# Altium project Altium101.PrjPcb (part 2 of 2)

## Sheet Wifi.SchDoc
size A3; CompanyName: Ok's Lab; Engineer: Oktay Topcu; SheetNumber: 6; SheetTotal: 7; UniqueID: 20200803; X1: Altium101.PrjPcb; X2: A3; X3: 20200803; X4: r1.0; X6: 6; X7: 7; X8: Wifi.SchDoc
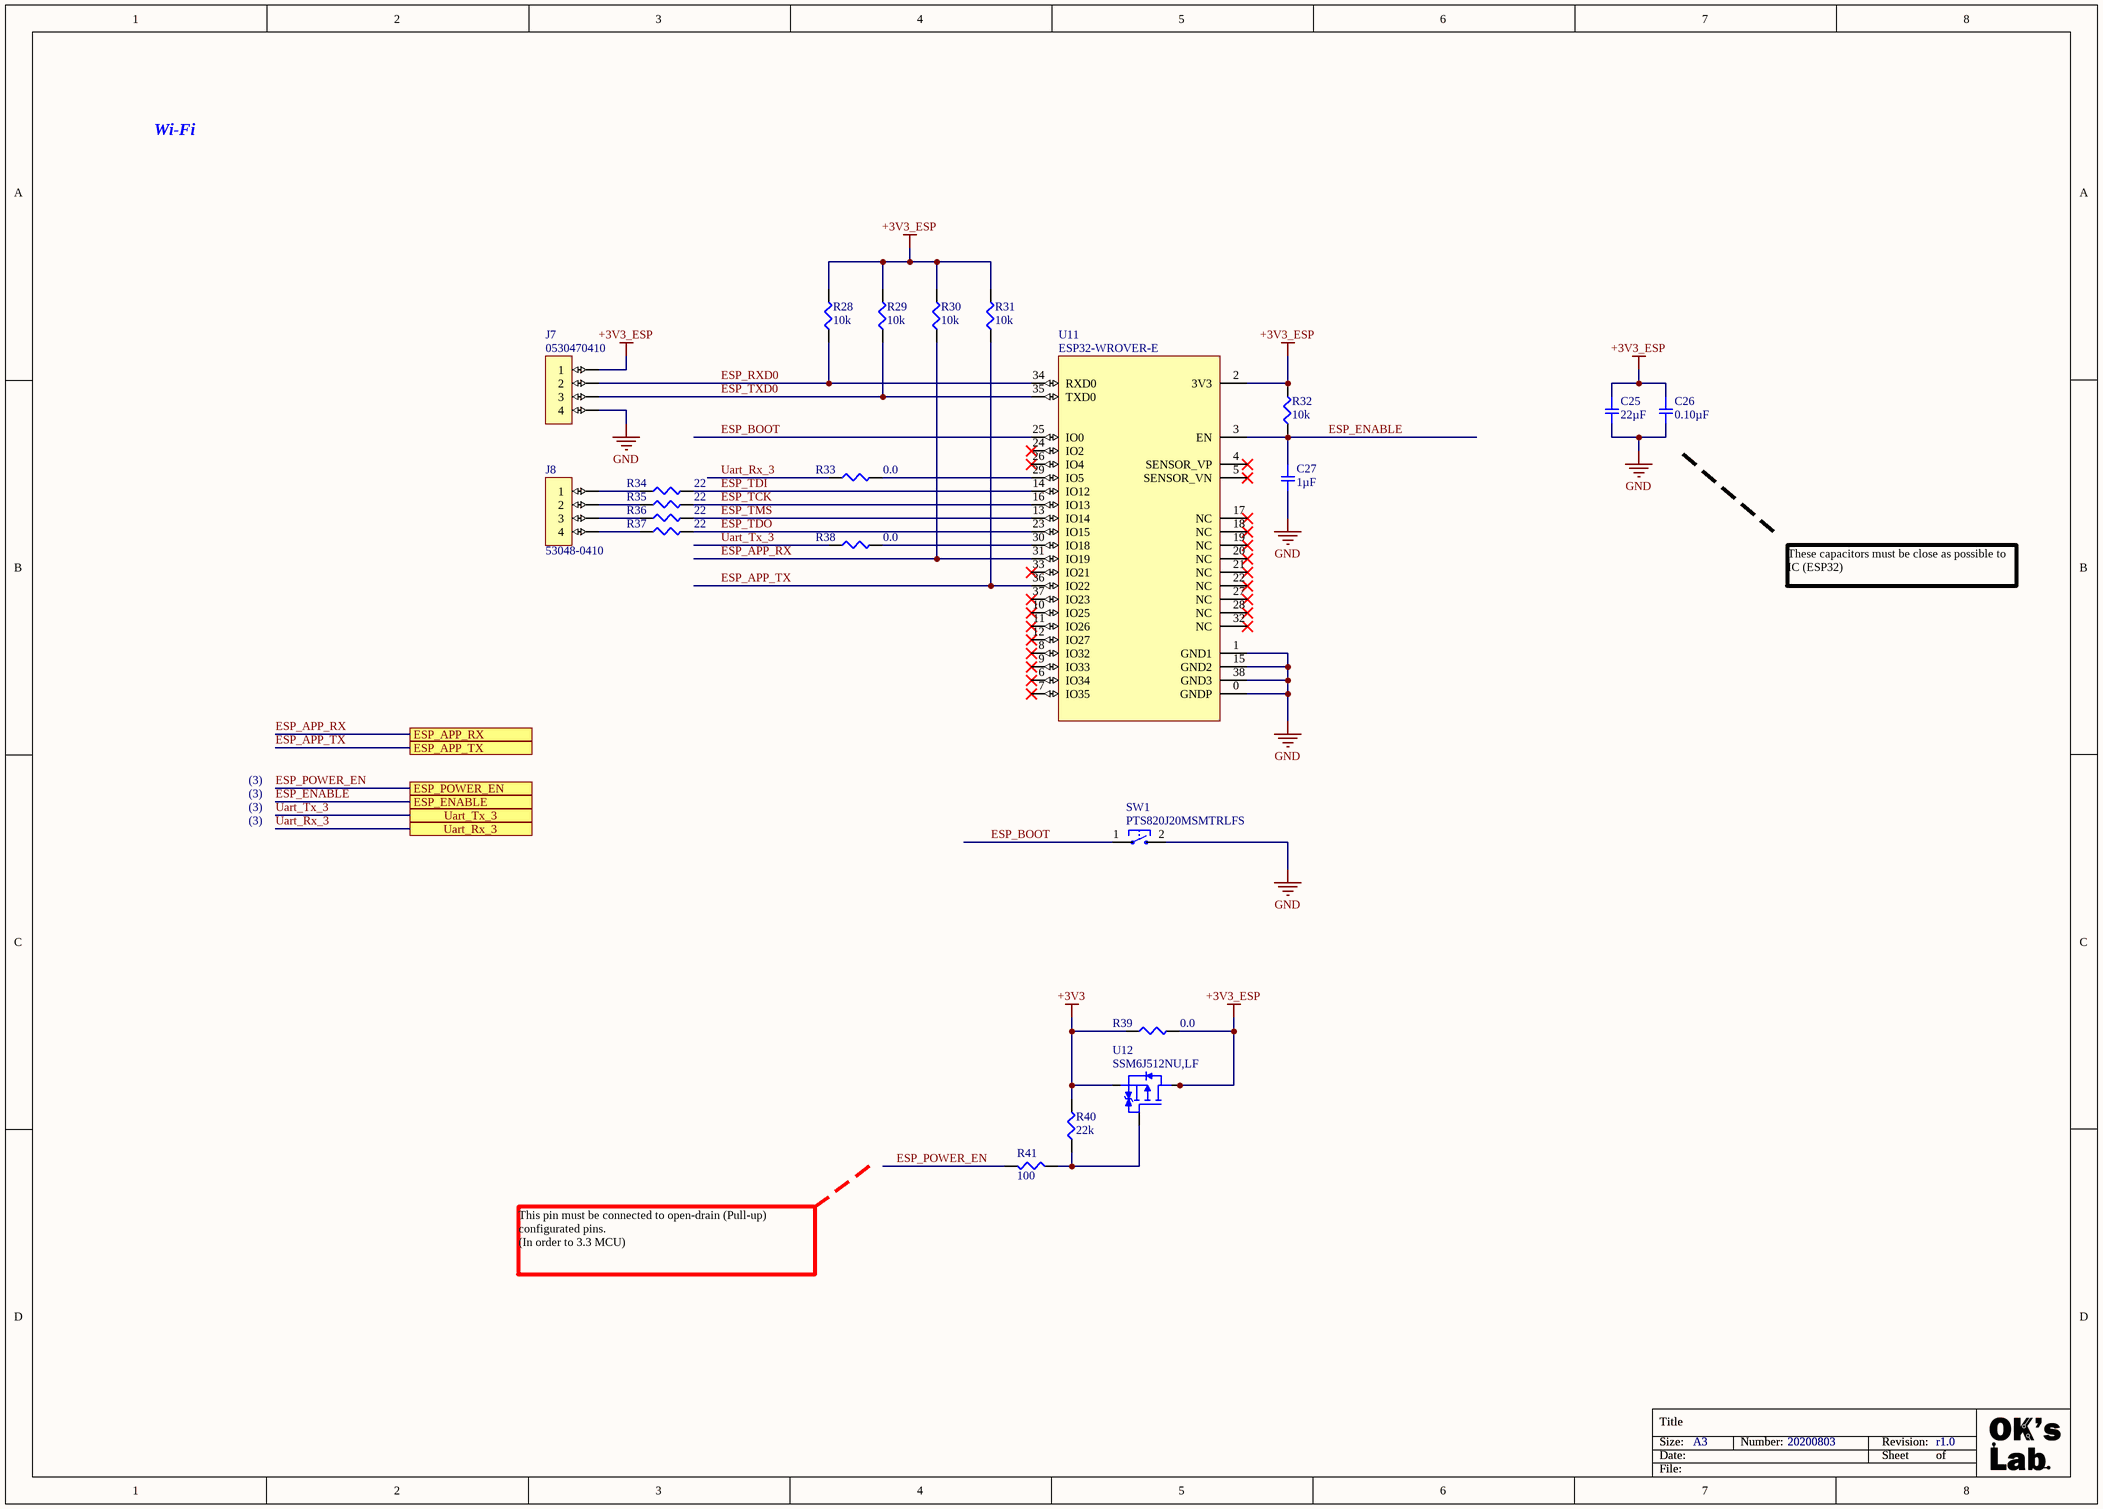
[diagram p5: Wifi.SchDoc]

### Parts
C25  22µF  [SMD-0805C]
C26  0.10µF  [SMD-0603C]
C27  1µF  [SMD-0603C]
J7  0530470410  [CONN_4_POS__053047-0410]
J8  53048-0410  [CONN_4_POS__0530480410]
R28  10k  [SMD-0603-RES]
R29  10k  [SMD-0603-RES]
R30  10k  [SMD-0603-RES]
R31  10k  [SMD-0603-RES]
R32  10k  [SMD-0603-RES]
R33  0.0  [SMD-0603-RES]
R34  22  [SMD-0603-RES]
R35  22  [SMD-0603-RES]
R36  22  [SMD-0603-RES]
R37  22  [SMD-0603-RES]
R38  0.0  [SMD-0603-RES]
R39  0.0  [SMD-0603-RES]
R40  22k  [SMD-0603-RES]
R41  100  [SMD-0603-RES]
SW1  PTS820J20MSMTRLFS  [TACTILE_SWITCH__PTS820J25MSMTRLFS]
U11  ESP32-WROVER-E  [ESP32-WROVER-E]
U12  SSM6J512NU,LF  [U-DFN2020-6]

### Ports
ESP_APP_RX, ESP_APP_TX, ESP_ENABLE, ESP_POWER_EN, Uart_Rx_3, Uart_Tx_3

### Nets
+3V3: R39.1 R40.2 U12.4(S)
+3V3_ESP: C25.1 C26.1 J7.1 R28.2 R29.2 R30.2 R31.2 R32.2 R39.2 U11.2(3V3) U12.1(D) U12.2(D) U12.5(D) U12.6(D)
GND: C25.2 C26.2 C27.2 J7.4 SW1.2 U11.0(GNDP) U11.1(GND1) U11.15(GND2) U11.38(GND3)
ESP_APP_RX: R30.1 U11.31(IO19) ; port ESP_APP_RX
ESP_APP_TX: R31.1 U11.36(IO22) ; port ESP_APP_TX
ESP_BOOT: SW1.1 U11.25(IO0)
ESP_ENABLE: C27.1 R32.1 U11.3(EN) ; port ESP_ENABLE
ESP_POWER_EN: R41.2 ; port ESP_POWER_EN
ESP_RXD0: J7.2 R28.1 U11.34(RXD0)
ESP_TCK: R35.2 U11.16(IO13)
ESP_TDI: R34.2 U11.14(IO12)
ESP_TDO: R37.2 U11.23(IO15)
ESP_TMS: R36.2 U11.13(IO14)
ESP_TXD0: J7.3 R29.1 U11.35(TXD0)
Uart_Rx_3: R33.1 ; port Uart_Rx_3
Uart_Tx_3: R38.1 ; port Uart_Tx_3
NetJ8_1: J8.1 R34.1
NetJ8_2: J8.2 R35.1
NetJ8_3: J8.3 R36.1
NetJ8_4: J8.4 R37.1
NetR33_2: R33.2 U11.29(IO5)
NetR38_2: R38.2 U11.30(IO18)
NetR40_1: R40.1 R41.1 U12.3(G)

Not connected (* = marked no-connect by the designer): U11 4(SENSOR_VP)* 5(SENSOR_VN)* 6(IO34)* 7(IO35)* 8(IO32)* 9(IO33)* 10(IO25)* 11(IO26)* 12(IO27)* 17(NC)* 18(NC)* 19(NC)* 20(NC)* 21(NC)* 22(NC)* 24(IO2)* 26(IO4)* 27(NC)* 28(NC)* 32(NC)* 33(IO21)* 37(IO23)*

### Notes on the sheet
- Wi-Fi
- These capacitors must be close as possible to IC (ESP32)
- (3)
- This pin must be connected to open-drain (Pull-up) configurated pins.
  (In order to 3.3 MCU)
- Title
- Size:
- Date:
- Number:
- Revision:
- Sheet
- of
- File:

### Library data of the parts
C25 = GRM21BC80J226ME51L: CAP CER 22UF 6.3V X6S 0805; Manufacturer: Murata Electronics North America; Factory Stock: 0; Unit Price (USD): 0.24; Minimum Quantity: 1; Tolerance: ±20%; Datasheets: http://www.murata.com/~/media/webrenewal/support/library/catalog/products/capacitor/mlcc/c02e.pdf; Image: //media.digikey.com/Renders/Murata%20Renders/0805%20(2012%20Metric)%20.85mm.jpg; Digi-Key Part Number: 490-9955-1-ND; Part Number: GRM21BC80J226ME51L; Quantity Available: 773; @ qty: 0; Packaging: Cut Tape (CT); Series: GRM; Part Status: Active; Value: 22µF; Voltage: 6.3V; Temperature Coefficient: X6S; Operating Temperature: -55°C ~ 105°C; Features: Derating Recommended; Ratings: -; Applications: General Purpose; Mounting Type: Surface Mount, MLCC; Package / Case: 0805 (2012 Metric); Size / Dimension: 0.079" L x 0.049" W (2.00mm x 1.25mm); Height - Seated (Max): -; Thickness (Max): 0.055" (1.40mm); Lead Spacing: -; Lead Style: -
C26 = GCJ188R71H104KA12D: CAP CER 0.1UF 50V X7R 0603; Manufacturer: Murata Electronics North America; Factory Stock: 0; Unit Price (USD): 0.12; Minimum Quantity: 1; Tolerance: ±10%; Datasheets: http://www.murata.com/~/media/webrenewal/support/library/catalog/products/capacitor/mlcc/c03e.ashx; Image: //media.digikey.com/Renders/Murata%20Renders/0603%28LQG18%29.jpg; Digi-Key Part Number: 490-5798-1-ND; Part Number: GCJ188R71H104KA12D; Quantity Available: 163695; @ qty: 0; Packaging: Cut Tape (CT); Series: GCJ; Part Status: Active; Value: 0.10µF; Voltage: 50V; Temperature Coefficient: X7R; Operating Temperature: -55°C ~ 125°C; Features: Soft Termination; Ratings: AEC-Q200; Applications: Automotive, Boardflex Sensitive; Mounting Type: Surface Mount, MLCC; Package / Case: 0603 (1608 Metric); Size / Dimension: 0.063" L x 0.031" W (1.60mm x 0.80mm); Height - Seated (Max): -; Thickness (Max): 0.035" (0.90mm); Lead Spacing: -; Lead Style: -
C27 = GCM188R71C105KA64D: CAP CER 1UF 16V X7R 0603; Manufacturer: Murata Electronics North America; Factory Stock: 0; Unit Price (USD): 0.24; Minimum Quantity: 1; Tolerance: ±10%; Datasheets: http://www.murata.com/~/media/webrenewal/support/library/catalog/products/capacitor/mlcc/c03e.ashx; Image: //media.digikey.com/Renders/Murata%20Renders/0603%28GCM188%29.jpg; Digi-Key Part Number: 490-5241-1-ND; Part Number: GCM188R71C105KA64D; Quantity Available: 9243; @ qty: 0; Packaging: Cut Tape (CT); Series: GCM; Part Status: Active; Value: 1µF; Voltage: 16V; Temperature Coefficient: X7R; Operating Temperature: -55°C ~ 125°C; Features: -; Ratings: AEC-Q200; Applications: Automotive; Mounting Type: Surface Mount, MLCC; Package / Case: 0603 (1608 Metric); Size / Dimension: 0.063" L x 0.031" W (1.60mm x 0.80mm); Height - Seated (Max): -; Thickness (Max): 0.035" (0.90mm); Lead Spacing: -; Lead Style: -
J7 = CONN_4_POS__53047-0410: 1.25mm (.049") Pitch PicoBlade Wire-to-Board Header, Vertical, with Friction Lock, 4 Circuits; Manufacturer: Molex; Number of Contacts: 4; Contact Resistance: 20mR; Max Voltage Rating (AC): 125V; Connector Type: Blade Pin; Pitch: 0.049inch; Supplier 1: Avnet; Manufacturer Part Number: 0530470410; Stock 1: 65946; Pricing 1: 1=0.1162, 10=0.1145, 30=0.1129, 50=0.1112, 100=0.1088, 250=0.1063, 500=0.1038 (USD); Mount: Through Hole; Contact Plating: Tin; Contact Material: Bronze; Color: Natural; Housing Color: White; Housing Material: Nylon; Min Operating Temperature: -40°C; Max Operating Temperature: 85°C; Termination: Solder; Number of Rows: 1; Packaging: Tray; Number of Positions: 4; Orientation: Straight; Series: PicoBlade™ 53047; Contact Type: Blade Pin; Length: 6.75mm; Depth: 3.2mm; Contact Mating Length: 0.089inch; RoHS Compliant: Yes; ComponentLink1URL: http://components.arrow.com/part/dataview/2938462S4237926N3303?src-supplier=Arrow+Electronics; ComponentLink1Description: http://components.arrow.com/part/dataview/2938462S4237926N3303?src-supplier=Arrow+Electronics; Supplier Part Number 1: 0530470410
J8 = CONN_4_POS__0530480410: CONN HEADER R/A 4POS 1.25MM; Manufacturer: Molex; Contact Resistance: 20mR; Current Rating: 1A; Voltage Rating: 125V; Number of Positions: 4; Insulation Resistance: 100MR; Gender: Male; Connector Type: Blade Pin; Glow Wire Compliant: Non-compliant; Supplier 1: Avnet; Manufacturer Part Number: 53048-0410; Stock 1: 44; Pricing 1: 1=0.1232 (USD); Mount: Through Hole; Case/Package: 0410; Contact Material: Bronze,Tin; Contact Plating: Tin; Color: Natural; Housing Color: Natural; Housing Material: Nylon; Min Operating Temperature: -40°C; Max Operating Temperature: 85°C; Package Quantity: 5000; Number of Rows: 1; Packaging: Tray; Contact Gender: Male; Termination: Solder; Number of Contacts: 4; Orientation: Right Angle; Number of Circuits: 4; Voltage Rating (DC): 125V; Series: PicoBlade; Contact Type: Blade Pin; Pitch: 1.25mm; Depth: 5.5mm; Radiation Hardening: No; REACH SVHC: Unknown; Lead Free: Lead Free; Flammability Rating: UL94 V-0; RoHS Compliant: Yes; ComponentLink1URL: https://www.distrelec.biz/Web/Downloads/60/_e/gg116847-116860_e.pdf?mime=application%2Fpdf&src-supplier=Distrelec; ComponentLink1Description: https://www.distrelec.biz/Web/Downloads/60/_e/gg116847-116860_e.pdf?mime=application%2Fpdf&src-supplier=Distrelec; ComponentLink2URL: http://uk.rs-online.com/webdocs/1362/0900766b81362ba7.pdf?src-supplier=RSComponents; ComponentLink2Description: http://uk.rs-online.com/webdocs/1362/0900766b81362ba7.pdf?src-supplier=RSComponents; ComponentLink3URL: http://www.molex.com/webdocs/datasheets/pdf/en-us/0530480410_PCB_HEADERS.pdf?src-supplier=Avnet; ComponentLink3Description: http://www.molex.com/webdocs/datasheets/pdf/en-us/0530480410_PCB_HEADERS.pdf?src-supplier=Avnet; ComponentLink4URL: http://www.mouser.com/ds/2/276/0530480410_PCB_HEADERS-170930.pdf?src-supplier=Mouser; ComponentLink4Description: http://www.mouser.com/ds/2/276/0530480410_PCB_HEADERS-170930.pdf?src-supplier=Mouser; Supplier Part Number 1: 53048-0410
R28-R32 = ERJ-3EKF1002V: RES SMD 10K OHM 1% 1/10W 0603; Manufacturer: Panasonic Electronic Components; Factory Stock: 0; Unit Price (USD): 0.00379; @ qty: 1500; Minimum Quantity: 1; Power (Watts): 0.1W, 1/10W; Temperature Coefficient: ±100ppm/°C; Part Number: ERJ-3EKF1002V; Datasheets: http://industrial.panasonic.com/www-cgi/jvcr13pz.cgi?E+PZ+3+AOA0002+ERJ3EKF1002V+7+WW; Image: //media.digikey.com/Photos/Panasonic%20Photos/MFG_ERJ-P6W%20Series.jpg; Digi-Key Part Number: P10.0KHCT-ND; Quantity Available: 6703141; Packaging: Cut Tape (CT); Series: ERJ; Part Status: Active; Value: 10k; Tolerance: ±1%; Composition: Thick Film; Features: Automotive AEC-Q200; Operating Temperature: -55°C ~ 155°C; Package / Case: 0603 (1608 Metric); Supplier Device Package: 0603; Size / Dimension: 0.063" L x 0.031" W (1.60mm x 0.80mm); Height - Seated (Max): 0.022" (0.55mm); Number of Terminations: 2; Failure Rate: -
R33 R38 R39 = ERJ-3GEY0R00V: RES SMD 0.0OHM JUMPER 1/10W 0603; Manufacturer: Panasonic Electronic Components; Factory Stock: 0; Unit Price (USD): 0.00352; @ qty: 1500; Minimum Quantity: 1; Power (Watts): 0.1W, 1/10W; Part Number: ERJ-3GEY0R00V; Datasheets: http://industrial.panasonic.com/www-cgi/jvcr13pz.cgi?E+PZ+3+AOA0001+ERJ3GEY0R00V+7+WW; Image: //media.digikey.com/Photos/Panasonic%20Photos/MFG_ERJ-P6W%20Series.jpg; Digi-Key Part Number: P0.0GCT-ND; Quantity Available: 4813372; Packaging: Cut Tape (CT); Series: ERJ; Part Status: Active; Value: 0.0; Tolerance: Jumper; Composition: Thick Film; Features: Automotive AEC-Q200; Temperature Coefficient: -; Operating Temperature: -55°C ~ 155°C; Package / Case: 0603 (1608 Metric); Supplier Device Package: 0603; Size / Dimension: 0.063" L x 0.031" W (1.60mm x 0.80mm); Height - Seated (Max): 0.022" (0.55mm); Number of Terminations: 2; Failure Rate: -
R34-R37 = ERJ-3EKF22R0V: RES SMD 22 OHM 1% 1/10W 0603; Manufacturer: Panasonic Electronic Components; Factory Stock: 0; Unit Price (USD): 0.00379; @ qty: 1500; Minimum Quantity: 1; Power (Watts): 0.1W, 1/10W; Temperature Coefficient: ±100ppm/°C; Part Number: ERJ-3EKF22R0V; Datasheets: http://industrial.panasonic.com/www-cgi/jvcr13pz.cgi?E+PZ+3+AOA0002+ERJ3EKF22R0V+7+WW; Image: //media.digikey.com/Photos/Panasonic%20Photos/MFG_ERJ-P6W%20Series.jpg; Digi-Key Part Number: P22.0HCT-ND; Quantity Available: 100321; Packaging: Cut Tape (CT); Series: ERJ; Part Status: Active; Value: 22; Tolerance: ±1%; Composition: Thick Film; Features: Automotive AEC-Q200; Operating Temperature: -55°C ~ 155°C; Package / Case: 0603 (1608 Metric); Supplier Device Package: 0603; Size / Dimension: 0.063" L x 0.031" W (1.60mm x 0.80mm); Height - Seated (Max): 0.022" (0.55mm); Number of Terminations: 2; Failure Rate: -
R40 = ERJ-3EKF2202V: RES SMD 22K OHM 1% 1/10W 0603; Manufacturer: Panasonic Electronic Components; Factory Stock: 0; Unit Price (USD): 0.00379; @ qty: 1500; Minimum Quantity: 1; Power (Watts): 0.1W, 1/10W; Temperature Coefficient: ±100ppm/°C; Datasheets: http://industrial.panasonic.com/www-cgi/jvcr13pz.cgi?E+PZ+3+AOA0002+ERJ3EKF2202V+7+WW; Image: //media.digikey.com/Photos/Panasonic%20Photos/MFG_ERJ-P6W%20Series.jpg; Digi-Key Part Number: P22.0KHCT-ND; Quantity Available: 328790; Packaging: Cut Tape (CT); Series: ERJ; Part Status: Active; Value: 22k; Tolerance: ±1%; Composition: Thick Film; Features: Automotive AEC-Q200; Operating Temperature: -55°C ~ 155°C; Package / Case: 0603 (1608 Metric); Supplier Device Package: 0603; Size / Dimension: 0.063" L x 0.031" W (1.60mm x 0.80mm); Height - Seated (Max): 0.022" (0.55mm); Number of Terminations: 2; Failure Rate: -; Manufacturer Part Number: ERJ-3EKF2202V
R41 = ERJ-3EKF1000V: RES SMD 100 OHM 1% 1/10W 0603; Manufacturer: Panasonic Electronic Components; Factory Stock: 0; Unit Price (USD): 0.00379; @ qty: 1500; Minimum Quantity: 1; Power (Watts): 0.1W, 1/10W; Temperature Coefficient: ±100ppm/°C; Datasheets: http://industrial.panasonic.com/www-cgi/jvcr13pz.cgi?E+PZ+3+AOA0002+ERJ3EKF1000V+7+WW; Image: //media.digikey.com/Photos/Panasonic%20Photos/MFG_ERJ-P6W%20Series.jpg; Digi-Key Part Number: P100HCT-ND; Quantity Available: 1544120; Packaging: Cut Tape (CT); Series: ERJ; Part Status: Active; Value: 100; Tolerance: ±1%; Composition: Thick Film; Features: Automotive AEC-Q200; Operating Temperature: -55°C ~ 155°C; Package / Case: 0603 (1608 Metric); Supplier Device Package: 0603; Size / Dimension: 0.063" L x 0.031" W (1.60mm x 0.80mm); Height - Seated (Max): 0.022" (0.55mm); Number of Terminations: 2; Failure Rate: -; Manufacturer Part Number: ERJ-3EKF1000V
SW1 = TACTILE_SWITCH__PTS820 J20M SMTR LFS: Switch Tactile N.O. SPST Round Button J-Bend 0.05A 12VDC 1.57N SMD T/R; Manufacturer: ITT C&K; Mechanical Life: 200000Cycles; Operating Force: 160gf; Current Rating: 50mA; Voltage Rating (DC): 12V; Illumination Type: Non-Illuminated; Switch Travel: 0.2mm; Switch Function: Off-Mom; Actuator Type: Standard; Supplier 1: Avnet; Manufacturer Part Number: PTS820J20MSMTRLFS; Stock 1: 0; Pricing 1: 2500=0.3899, 5000=0.3776, 10000=0.3585, 15000=0.3489, 20000=0.3322, 25000=0.3227, 250000=0.1769 (USD); Mount: Surface Mount; Case/Package: SMD/SMT; Color: Silver; Contact Plating: Silver; Min Operating Temperature: -40°C; Max Operating Temperature: 85°C; Packaging: Tape and Reel; Throw Configuration: SPST; Package Quantity: 2500; RoHS Compliant: Yes; Lead Free: Lead Free; ComponentLink1URL: https://www.ckswitches.com/media/1474/pts820.pdf?src-supplier=Digi-Key; ComponentLink1Description: https://www.ckswitches.com/media/1474/pts820.pdf?src-supplier=Digi-Key; Supplier Part Number 1: Y97MT26B2MBFP
U11 = ESP32-WROVER-E (4MB): RX TXRX MOD WIFI PCB TRACE SMD; Manufacturer: ESPRESSIF; Unit: pcs; SuppliedAmount: 0; MinAmount: 1; Type of communications module: IoT; Interface: GPIO; Receiver sensitivity: -98dBm; Transmitter output power: 19.5dBm; Supply voltage: 3...3.6V DC; Components: ESP32-D0WD-V3; Flash memory capacity: 4MB; SRAM memory capacity: 8MB; Number of cores: 2; Kind of network: Bluetooth Low Energy; Band: 2.412...2.484GHz; Supplier 1: TME; Manufacturer Part Number: ESP32-WROVER-E; Category: IoT (WiFi/Bluetooth) modules; Stock 1: 1; Pricing 1: 1=3,65, 5=3,5, 25=3,4, 100=3,15 (USD); Weight: 2,696; Multiples: 1; Price Type: NET; Dimensions: 18x31.4x3.3mm; Mounting: SMD; Kind of antenna: PCB; ComponentLink1URL: http://www.tme.eu/en/details/esp32-wrover-e/iot-wifi-bluetooth-modules/espressif/; ComponentLink1Description: http://www.tme.eu/en/details/esp32-wrover-e/iot-wifi-bluetooth-modules/espressif/; Supplier Part Number 1: ESP32-WROVER-E
U12 = MOSFET__SSM6J512NU,LF: MOSFET P-CH 12V 10A 6UDFNB; Manufacturer: Toshiba; Rds On Max: 16.2mR; Input Capacitance: 1.4nF; Max Power Dissipation: 1.25W; Supplier 1: Avnet; Manufacturer Part Number: SSM6J512NU,LF; Stock 1: 0; Pricing 1: 3000=0.1209, 6000=0.1177, 12000=0.1122, 18000=0.109, 24000=0.1067, 30000=0.1035, 300000=0.1011 (USD); Mount: Surface Mount; Packaging: Tape and Reel; Drain to Source Voltage (Vdss): 12V; Continuous Drain Current (ID): 10A; ComponentLink1URL: http://www.mouser.com/ds/2/408/SSM6J512NU_datasheet_en_20150903-805986.pdf?src-supplier=Mouser; ComponentLink1Description: http://www.mouser.com/ds/2/408/SSM6J512NU_datasheet_en_20150903-805986.pdf?src-supplier=Mouser; ComponentLink2URL: http://toshiba.semicon-storage.com/info/docget.jsp?did=30386&prodName=SSM6J512NU&src-supplier=Digi-Key; ComponentLink2Description: http://toshiba.semicon-storage.com/info/docget.jsp?did=30386&prodName=SSM6J512NU&src-supplier=Digi-Key; Supplier Part Number 1: SSM6J512NU,LF

## Sheet Power.SchDoc
size A3; CompanyName: Ok's Lab; Engineer: Oktay Topcu; SheetNumber: 2; SheetTotal: 7; UniqueID: 20200803; X1: Altium101.PrjPcb; X2: A3; X3: 20200803; X4: r1.0; X6: 2; X7: 7; X8: Power.SchDoc
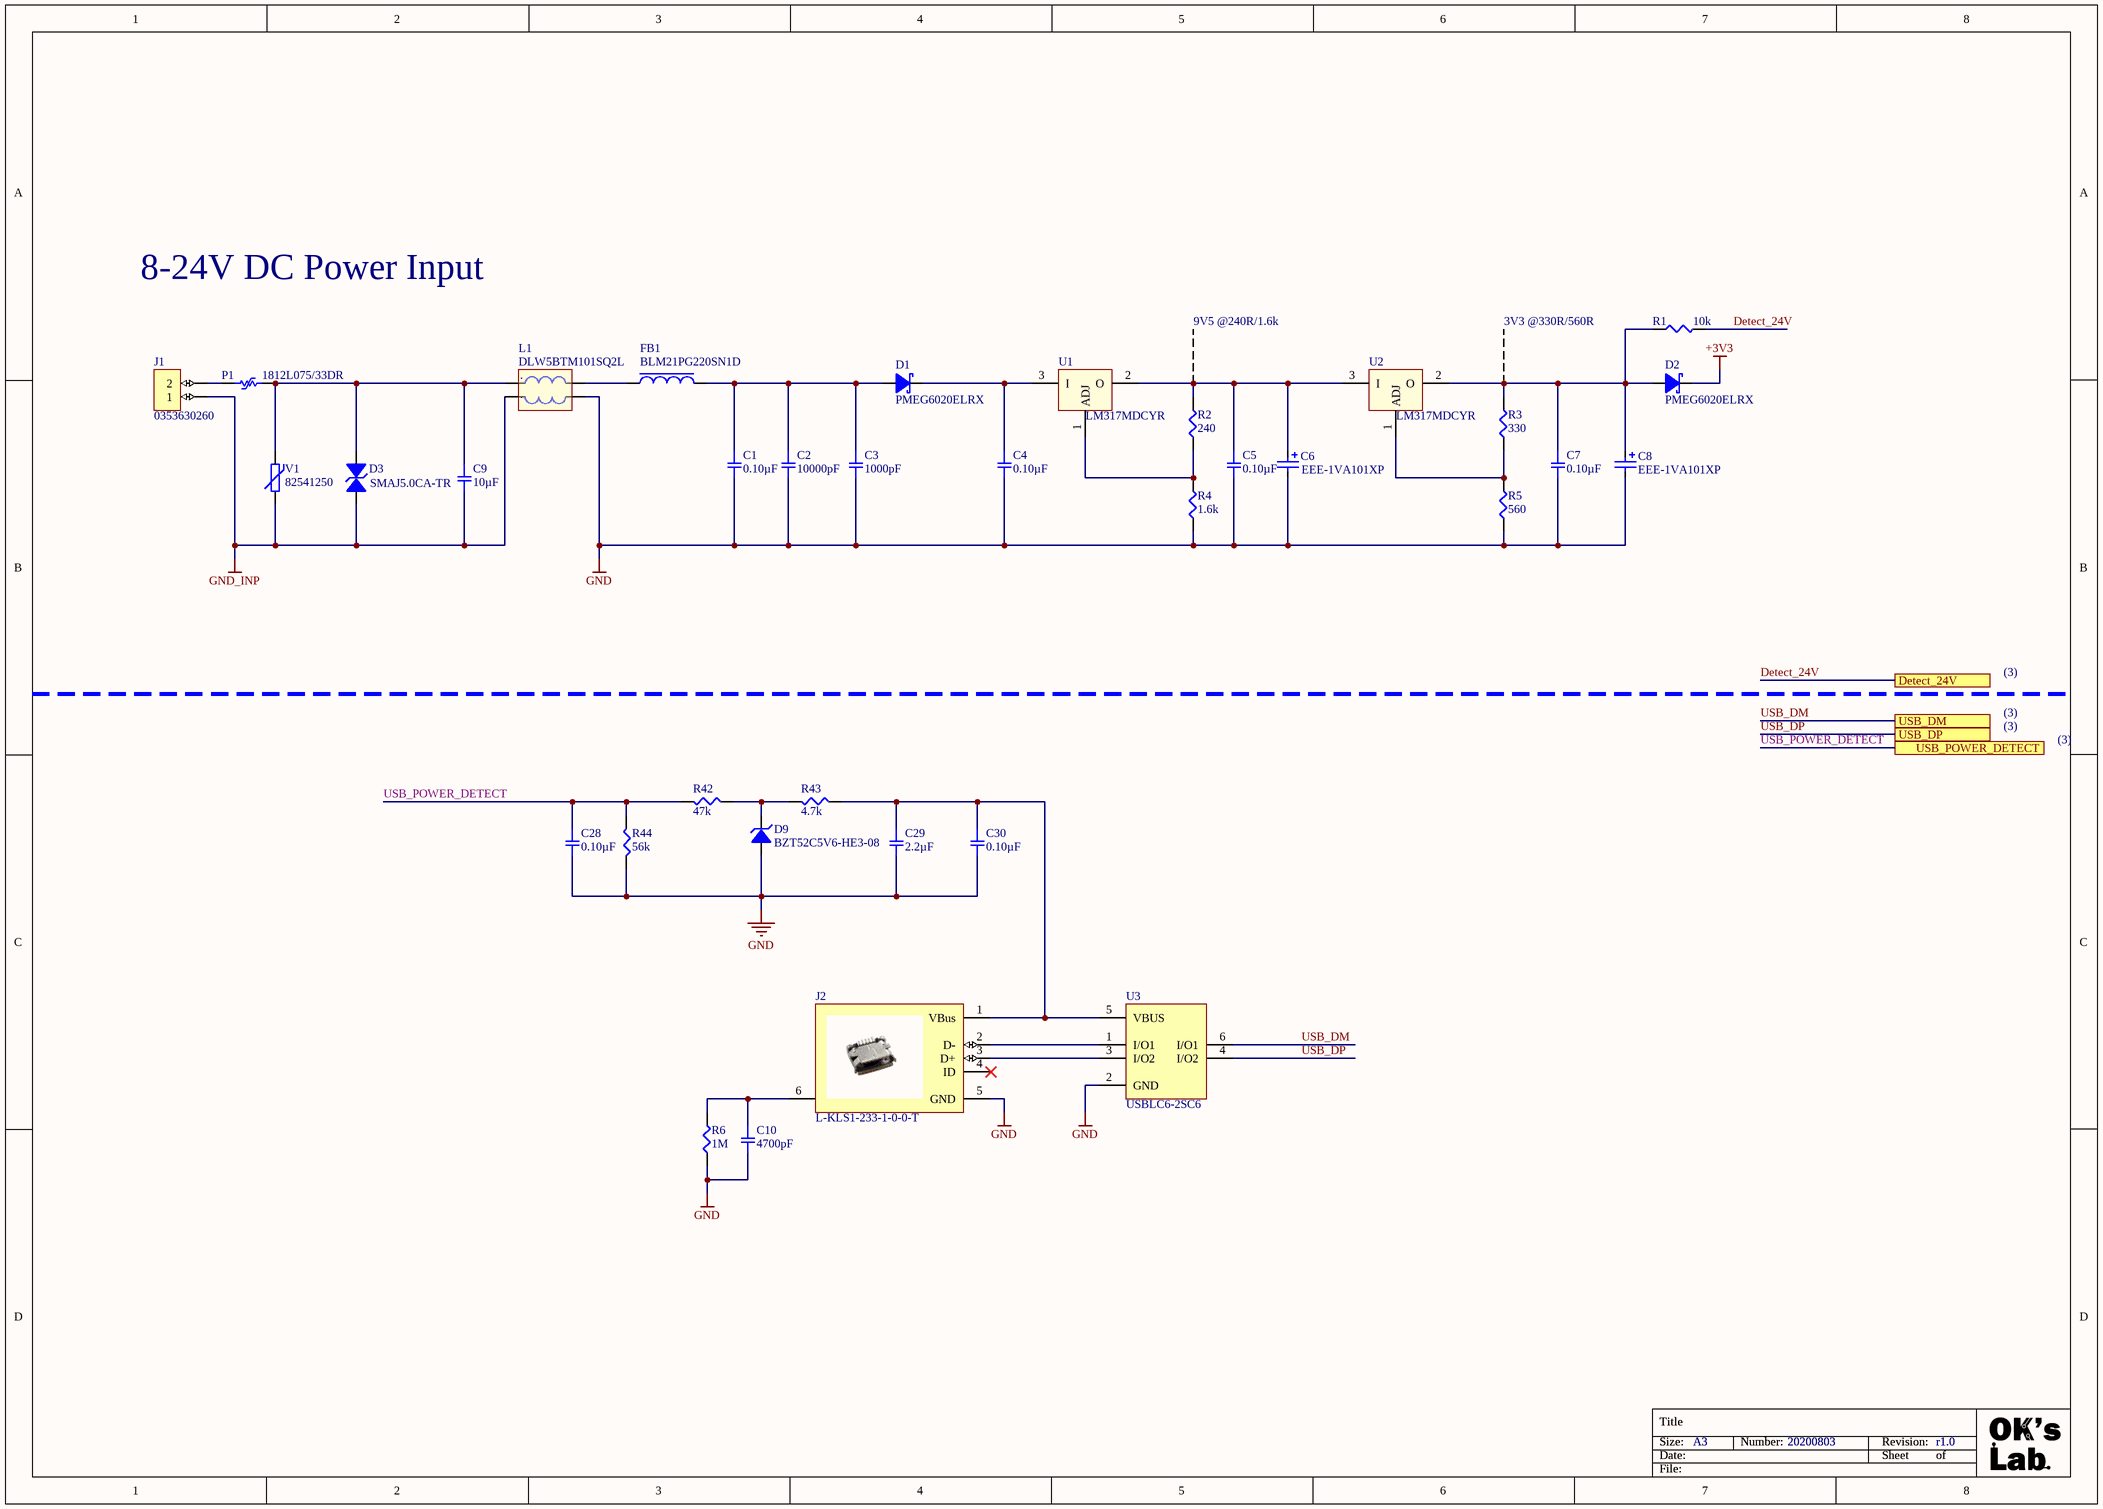
[diagram p6: Power.SchDoc]

### Parts
C1  0.10µF  [SMD-0805C]
C2  10000pF  [SMD-0805C]
C3  1000pF  [SMD-0805C]
C4  0.10µF  [SMD-0805C]
C5  0.10µF  [SMD-0805C]
C6  EEE-1VA101XP  [AE_C_R6]
C7  0.10µF  [SMD-0805C]
C8  EEE-1VA101XP  [AE_C_R6]
C9  10µF  [SMD-1206C]
C10  4700pF  [SMD-0805C]
C28  0.10µF  [SMD-0603C]
C29  2.2µF  [SMD-0603C]
C30  0.10µF  [SMD-0603C]
D1  PMEG6020ELRX  [SOD123W]
D2  PMEG6020ELRX  [SOD123W]
D3  SMAJ5.0CA-TR  [DO-214AA-SMB -nonPOL]
D9  BZT52C5V6-HE3-08  [SOD123]
FB1  BLM21PG220SN1D  [L-0805]
J1  0353630260  [CONN_2_POS__0353630260]
J2  L-KLS1-233-1-0-0-T  [USB_MICRO_1981584-1]
L1  DLW5BTM101SQ2L  [DLW5BTMxxxxxxx]
P1  1812L075/33DR  [PTC-1812]
R1  10k  [SMD-0603-RES]
R2  240  [SMD-0603-RES]
R3  330  [SMD-0603-RES]
R4  1.6k  [SMD-0603-RES]
R5  560  [SMD-0603-RES]
R6  1M  [SMD-0805-RES]
R42  47k  [SMD-0603-RES]
R43  4.7k  [SMD-0603-RES]
R44  56k  [SMD-0603-RES]
U1  LM317MDCYR  [SOT-223-4]
U2  LM317MDCYR  [SOT-223-4]
U3  USBLC6-2SC6  [SOT23-6]
V1  82541250  [V-1206]

### Ports
Detect_24V, USB_DM, USB_DP, USB_POWER_DETECT

### Nets
+3V3: D2.1(K)
GND: C1.2 C2.2 C3.2 C4.2 C5.2 C6.2 C7.2 C8.2 C10.2 C28.2 C29.2 C30.2 D9.1(T1) J2.5(GND) L1.3(B2) R4.1 R5.1 R6.1 R44.1 U3.2(GND)
GND_INP: C9.2 D3.2(T2) J1.1 L1.4(B1) V1.1
Detect_24V: R1.2 ; port Detect_24V
USB_DM: U3.6(I/O1) ; port USB_DM
USB_DP: U3.4(I/O2) ; port USB_DP
USB_POWER_DETECT: C28.1 R42.2 R44.2 ; port USB_POWER_DETECT
NetC1_1: C1.1 C2.1 C3.1 D1.2(A) FB1.2
NetC4_1: C4.1 D1.1(K) U1.3(I)
NetC5_1: C5.1 C6.1 R2.2 U1.2(O) U2.3(I)
NetC7_1: C7.1 C8.1 D2.2(A) R1.1 R3.2 U2.2(O)
NetC9_1: C9.1 D3.1(T1) L1.1(A1) P1.2 V1.2
NetC10_1: C10.1 J2.6(Shield) R6.2
NetC29_1: C29.1 C30.1 J2.1(VBus) R43.1 U3.5(VBUS)
NetD9_2: D9.2(T2) R42.1 R43.2
NetFB1_1: FB1.1 L1.2(A2)
NetJ1_2: J1.2 P1.1
NetJ2_2: J2.2(D-) U3.1(I/O1)
NetJ2_3: J2.3(D+) U3.3(I/O2)
NetR2_1: R2.1 R4.2 U1.1(ADJ)
NetR3_1: R3.1 R5.2 U2.1(ADJ)

Not connected (* = marked no-connect by the designer): J2 4(ID)*

### Notes on the sheet
- 8-24V DC Power Input
- 9V5 @240R/1.6k
- 3V3 @330R/560R
- (3)
- Title
- Size:
- Date:
- Number:
- Revision:
- Sheet
- of
- File:
- (in symbol DLW5BTM101SQ2L) .

### Library data of the parts
C1 C4 C5 C7 = GCD21BR71H104KA01L: CAP CER 0.1UF 50V X7R 0805; Manufacturer: Murata Electronics North America; Factory Stock: 0; Unit Price (USD): 0.24; Minimum Quantity: 1; Tolerance: ±10%; Datasheets: http://www.murata.com/~/media/webrenewal/support/library/catalog/products/capacitor/mlcc/c03e.ashx; Image: //media.digikey.com/Renders/Murata%20Renders/0805%28GxM6%29.jpg; Digi-Key Part Number: 490-11955-1-ND; Part Number: GCD21BR71H104KA01L; Quantity Available: 157; @ qty: 0; Packaging: Cut Tape (CT); Series: GCD; Part Status: Active; Value: 0.10µF; Voltage: 50V; Temperature Coefficient: X7R; Operating Temperature: -55°C ~ 125°C; Features: -; Ratings: AEC-Q200; Applications: Automotive; Mounting Type: Surface Mount, MLCC; Package / Case: 0805 (2012 Metric); Size / Dimension: 0.079" L x 0.049" W (2.00mm x 1.25mm); Height - Seated (Max): -; Thickness (Max): 0.049" (1.25mm); Lead Spacing: -; Lead Style: -
C2 = GCJ216R71H103KA01D: CAP CER 10000PF 50V X7R 0805; Manufacturer: Murata Electronics North America; Factory Stock: 0; Unit Price (USD): 0.24; Minimum Quantity: 1; Tolerance: ±10%; Datasheets: http://www.murata.com/~/media/webrenewal/support/library/catalog/products/capacitor/mlcc/c03e.ashx; Image: //media.digikey.com/Renders/Murata%20Renders/0805%20(2012%20Metric)%20.85mm.jpg; Digi-Key Part Number: 490-5841-1-ND; Part Number: GCJ216R71H103KA01D; Quantity Available: 15990; @ qty: 0; Packaging: Cut Tape (CT); Series: GCJ; Part Status: Active; Value: 10000pF; Voltage: 50V; Temperature Coefficient: X7R; Operating Temperature: -55°C ~ 125°C; Features: Soft Termination; Ratings: AEC-Q200; Applications: Automotive, Boardflex Sensitive; Mounting Type: Surface Mount, MLCC; Package / Case: 0805 (2012 Metric); Size / Dimension: 0.079" L x 0.049" W (2.00mm x 1.25mm); Height - Seated (Max): -; Thickness (Max): 0.024" (0.60mm); Lead Spacing: -; Lead Style: -
C3 = GCJ216R71H102KA01D: CAP CER 1000PF 50V X7R 0805; Manufacturer: Murata Electronics North America; Factory Stock: 0; Unit Price (USD): 0.24; Minimum Quantity: 1; Tolerance: ±10%; Datasheets: http://www.murata.com/~/media/webrenewal/support/library/catalog/products/capacitor/mlcc/c03e.ashx; Image: //media.digikey.com/Renders/Murata%20Renders/0805%20(2012%20Metric)%20.85mm.jpg; Digi-Key Part Number: 490-5813-1-ND; Part Number: GCJ216R71H102KA01D; Quantity Available: 3433; @ qty: 0; Packaging: Cut Tape (CT); Series: GCJ; Part Status: Active; Value: 1000pF; Voltage: 50V; Temperature Coefficient: X7R; Operating Temperature: -55°C ~ 125°C; Features: Soft Termination; Ratings: AEC-Q200; Applications: Automotive, Boardflex Sensitive; Mounting Type: Surface Mount, MLCC; Package / Case: 0805 (2012 Metric); Size / Dimension: 0.079" L x 0.049" W (2.00mm x 1.25mm); Height - Seated (Max): -; Thickness (Max): 0.024" (0.60mm); Lead Spacing: -; Lead Style: -
C6 C8 = Capacitor_(Electrolytic)__EEE-1VA101XP: CAP ALUM 100UF 20% 35V SMD; Manufacturer: Panasonic Electronic Components; Capacitance: 100µF; Ripple Current: 132mA @ 120Hz; Polarization: Polar; Lifetime @ Temp.: 2000 Hrs @ 85°C; Surface Mount Land Size: 0.260" L x 0.260" W (6.60mm x 6.60mm); Package / Case: Radial, Can - SMD; Mounting Type: Surface Mount; Manufacturer Part Number: EEE-1VA101XP; Voltage Rating: 35V; Operating Temperature: -40°C ~ 85°C; Packaging: Tape & Reel (TR); Height - Seated (Max): 0.303" (7.70mm); Supplier: Digi-Key; Applications: General Purpose; RoHS: RoHS Compliant; Tolerance: ±20%; Impedance: -; Lead Spacing: -; Size / Dimension: 0.248" Dia (6.30mm); ESR (Equivalent Series Resistance): -; Category: Capacitors; Part Status: Active; ComponentLink1URL: https://industrial.panasonic.com/cdbs/www-data/pdf/RDE0000/ABA0000C1145.pdf; ComponentLink1Description: https://industrial.panasonic.com/cdbs/www-data/pdf/RDE0000/ABA0000C1145.pdf; Pricing: 900=0.1006, 1800=0.09557, 2700=0.09054, 4500=0.08551, 9000=0.08048, 22500=0.07796, 45000=0.07545, 90000=0.07042 (USD); Stock: 45900; Supplier Part Number: PCE3951TR-ND
C9 = GRM31CR61H106KA12L: CAP CER 10UF 50V X5R 1206; Manufacturer: Murata Electronics North America; Factory Stock: 0; Unit Price (USD): 0.65; Minimum Quantity: 1; Tolerance: ±10%; Datasheets: http://www.murata.com/~/media/webrenewal/support/library/catalog/products/capacitor/mlcc/c02e.pdf; Image: //media.digikey.com/Renders/Murata%20Renders/GR331BD72E473KW01L.jpg; Digi-Key Part Number: 490-5961-1-ND; Part Number: GRM31CR61H106KA12L; Quantity Available: 86736; @ qty: 0; Packaging: Cut Tape (CT); Series: GRM; Part Status: Active; Value: 10µF; Voltage: 50V; Temperature Coefficient: X5R; Operating Temperature: -55°C ~ 85°C; Features: -; Ratings: -; Applications: General Purpose; Mounting Type: Surface Mount, MLCC; Package / Case: 1206 (3216 Metric); Size / Dimension: 0.126" L x 0.063" W (3.20mm x 1.60mm); Height - Seated (Max): -; Thickness (Max): 0.071" (1.80mm); Lead Spacing: -; Lead Style: -
C10 = GCJ21AR72E472KXJ1D: CAP CER 4700PF 250V X7R 0805; Manufacturer: Murata Electronics North America; Factory Stock: 0; Unit Price (USD): 0.3; Minimum Quantity: 1; Tolerance: ±10%; Datasheets: http://www.murata.com/~/media/webrenewal/support/library/catalog/products/capacitor/mlcc/c03e.ashx; Image: //media.digikey.com/Renders/Murata%20Renders/0805%20(2012%20Metric)%20.85mm.jpg; Digi-Key Part Number: 490-5593-1-ND; Part Number: GCJ21AR72E472KXJ1D; Quantity Available: 1082; @ qty: 0; Packaging: Cut Tape (CT); Series: GCJ; Part Status: Active; Value: 4700pF; Voltage: 250V; Temperature Coefficient: X7R; Operating Temperature: -55°C ~ 125°C; Features: Soft Termination; Ratings: AEC-Q200; Applications: Automotive, Boardflex Sensitive; Mounting Type: Surface Mount, MLCC; Package / Case: 0805 (2012 Metric); Size / Dimension: 0.079" L x 0.049" W (2.00mm x 1.25mm); Height - Seated (Max): -; Thickness (Max): 0.039" (1.00mm); Lead Spacing: -; Lead Style: -
C28 C30 = GCJ188R71H104KA12D: as C26 on sheet Wifi; Datasheets: http://www.murata.com/~/media/webrenewal/support/library/catalog/products/capacitor/mlcc/c03e.ashx; Image: //media.digikey.com/Renders/Murata%20Renders/0603%28LQG18%29.jpg; Digi-Key Part Number: 490-5798-1-ND; Quantity Available: 163695; @ qty: 0; Packaging: Cut Tape (CT); Series: GCJ; Part Status: Active; Value: 0.10µF; Voltage: 50V; Temperature Coefficient: X7R; Operating Temperature: -55°C ~ 125°C; Features: Soft Termination; Ratings: AEC-Q200; Applications: Automotive, Boardflex Sensitive; Mounting Type: Surface Mount, MLCC; Package / Case: 0603 (1608 Metric); Size / Dimension: 0.063" L x 0.031" W (1.60mm x 0.80mm); Height - Seated (Max): -; Thickness (Max): 0.035" (0.90mm); Lead Spacing: -; Lead Style: -; Manufacturer Part Number: GCJ188R71H104KA12D
C29 = GRM188C71C225KE11D: CAP CER 2.2UF 16V X7S 0603; Manufacturer: Murata Electronics North America; Factory Stock: 0; Unit Price (USD): 0.25; Minimum Quantity: 1; Tolerance: ±10%; Datasheets: http://www.murata.com/~/media/webrenewal/support/library/catalog/products/capacitor/mlcc/c02e.pdf; Image: //media.digikey.com/Renders/Murata%20Renders/ZRB-SERIES-0402.jpg; Digi-Key Part Number: 490-12731-1-ND; Quantity Available: 3900; @ qty: 0; Packaging: Cut Tape (CT); Series: GRM; Part Status: Active; Value: 2.2µF; Voltage: 16V; Temperature Coefficient: X7S; Operating Temperature: -55°C ~ 125°C; Features: -; Ratings: -; Applications: General Purpose; Mounting Type: Surface Mount, MLCC; Package / Case: 0603 (1608 Metric); Size / Dimension: 0.063" L x 0.031" W (1.60mm x 0.80mm); Height - Seated (Max): -; Thickness (Max): 0.039" (1.00mm); Lead Spacing: -; Lead Style: -; Manufacturer Part Number: GRM188C71C225KE11D
D1 D2 = DIODE_PMEG6020ELRX: DIODE SCHOTTKY 60V 2A CFP3; Manufacturer: Nexperia; Supplier 1: Avnet; Manufacturer Part Number: PMEG6020ELRX; Stock 1: 0; Pricing 1: 12000=0.0781, 18000=0.0762, 30000=0.0747, 60000=0.0732, 120000=0.0711, 600000=0.0691, 1200000=0.0671 (USD); RoHS Compliant: Yes; ComponentLink1URL: https://assets.nexperia.com/documents/data-sheet/PMEG6020ELR.pdf?src-supplier=Digi-Key; ComponentLink1Description: https://assets.nexperia.com/documents/data-sheet/PMEG6020ELR.pdf?src-supplier=Digi-Key; ComponentLink2URL: http://www.farnell.com/datasheets/2168440.pdf?src-supplier=Farnell; ComponentLink2Description: http://www.farnell.com/datasheets/2168440.pdf?src-supplier=Farnell; ComponentLink3URL: http://www.farnell.com/datasheets/2168440.pdf?src-supplier=Newark; ComponentLink3Description: http://www.farnell.com/datasheets/2168440.pdf?src-supplier=Newark; Supplier Part Number 1: PMEG6020ELRX
D3 = DIODE_SMBJ26CA: TVS DIODE 26VWM 42.1VC SMB; Manufacturer: STMicroelectronics; Power Line Protection: No; Voltage - Breakdown (Min): 6.4V; Power - Peak Pulse: 400W; Voltage - Clamping (Max) @ Ipp: 13.4V; Current - Peak Pulse (10/1000µs): 174A (8/20µs); Voltage - Reverse Standoff (Typ): 5V; Type: Zener; Supplier: Digi-Key; Package / Case: DO-214AC, SMA; Capacitance @ Frequency: -; Packaging: Tape & Reel (TR); Operating Temperature: -55°C ~ 150°C (TJ); Applications: General Purpose; Supplier Device Package: SMA (DO-214AC); Part Status: Active; RoHS: RoHS Compliant; Category: Circuit Protection; Mounting Type: Surface Mount; Manufacturer Part Number: SMAJ5.0CA-TR; ComponentLink1URL: http://www.littelfuse.com/~/media/electronics/datasheets/tvs_diodes/littelfuse_tvs_diode_smbj_datasheet.pdf.pdf; ComponentLink1Description: http://www.littelfuse.com/~/media/electronics/datasheets/tvs_diodes/littelfuse_tvs_diode_smbj_datasheet.pdf.pdf; Pricing: 5000=0.10579, 10000=0.09896, 25000=0.091 (USD); Supplier Part Number: 497-6508-2-ND; Base Part Number: SMAJ; ComponentLink2URL: http://www.st.com/content/ccc/resource/technical/document/datasheet/ff/c0/80/cc/19/4c/45/af/CD00001333.pdf/files/CD00001333.pdf/_jcr_content/translations/en.CD00001333.pdf; ComponentLink2Description: http://www.st.com/content/ccc/resource/technical/document/datasheet/ff/c0/80/cc/19/4c/45/af/CD00001333.pdf/files/CD00001333.pdf/_jcr_content/translations/en.CD00001333.pdf
D9 = DIODE_BZT52C5V6-HE3-08: DIODE ZENER 5.6V 410MW SOD123; Manufacturer: Vishay; Voltage Tolerance: 5%; Zener Current: 59mA; Power Dissipation: 500mW; Max Reverse Leakage Current: 100nA; Impedance: 10R; Element Configuration: Single; Supplier 1: Avnet; Manufacturer Part Number: BZT52C5V6-HE3-08; Stock 1: 0; Pricing 1: 3000=0.0519, 6000=0.0449, 12000=0.0447, 18000=0.0378, 24000=0.0376, 30000=0.0352, 300000=0.0328 (USD); Mount: Surface Mount; Number of Pins: 2; Min Operating Temperature: -55°C; Max Operating Temperature: 150°C; Packaging: Tape and Reel; Package Quantity: 3000; Zener Voltage: 5.6V; Max Power Dissipation: 410mW; Tolerance: 5%; ComponentLink1URL: http://www.mouser.com/ds/2/427/bzt52-106265.pdf?src-supplier=Mouser; ComponentLink1Description: http://www.mouser.com/ds/2/427/bzt52-106265.pdf?src-supplier=Mouser; Supplier Part Number 1: BZT52C5V6-HE3-08
FB1 = Ferrite_Bead__BLM21PG220SN1D: FERRITE BEAD 22 OHM 0805 1LN; Manufacturer: Murata; Manufacturer Series: BLM21P; Material: Steel,Ferrite; Impedance: 22R; DC Resistance (DCR): 9mR; Tolerance: 25%; Current Rating: 6A; Shielding: Unshielded; Number of Circuits: 1; Resistance: 10mR; Test Frequency: 100MHz; Supplier 1: Avnet; Manufacturer Part Number: BLM21PG220SN1D; Stock 1: 0; Pricing 1: 4000=0.0273, 8000=0.0267, 16000=0.0263, 24000=0.0256, 32000=0.025 (USD); Case/Package: 0805; Number of Pins: 2; Core Material: Ferrite; Case Code (Metric): 2012; Case Code (Imperial): 0805; Weight: 0.000194oz; Terminal Finish: Tin; Min Operating Temperature: -55°C; Max Operating Temperature: 125°C; Packaging: Tape and Reel; Max DC Current: 6A; Number of Lines: 1; Series: BLM21P; Package Quantity: 1; Max Current Rating: 6A; Termination: SMD/SMT; DC Current: 6A; DC Resistance-Max: 9mR; Number of Functions: 1; Length: 2mm; Width: 1.25mm; Height: 0.85mm; Depth: 1.25mm; Radiation Hardening: No; REACH SVHC: No SVHC; Lead Free: Lead Free; RoHS Compliant: Yes; ComponentLink1URL: http://www.murata.com/products/catalog/pdf/c31e.pdf?src-supplier=Element14; ComponentLink1Description: http://www.murata.com/products/catalog/pdf/c31e.pdf?src-supplier=Element14; ComponentLink2URL: http://www.murata.com/products/catalog/pdf/c31e.pdf?src-supplier=Distrelec; ComponentLink2Description: http://www.murata.com/products/catalog/pdf/c31e.pdf?src-supplier=Distrelec; ComponentLink3URL: http://www.jameco.com/Jameco/Products/ProdDS/1845312.pdf?src-supplier=Jameco; ComponentLink3Description: http://www.jameco.com/Jameco/Products/ProdDS/1845312.pdf?src-supplier=Jameco; ComponentLink4URL: https://www.murata.com/en-us/products/productdata/8796738977822/ENFA0005.pdf?src-supplier=Digi-Key; ComponentLink4Description: https://www.murata.com/en-us/products/productdata/8796738977822/ENFA0005.pdf?src-supplier=Digi-Key; ComponentLink5URL: http://uk.rs-online.com/webdocs/13ec/0900766b813ecf58.pdf?src-supplier=RSComponents; ComponentLink5Description: http://uk.rs-online.com/webdocs/13ec/0900766b813ecf58.pdf?src-supplier=RSComponents; ComponentLink6URL: http://www.murata.com/products/catalog/pdf/c31e.pdf?src-supplier=Avnet; ComponentLink6Description: http://www.murata.com/products/catalog/pdf/c31e.pdf?src-supplier=Avnet; ComponentLink7URL: http://search.murata.co.jp/Ceramy/image/img/PDF/ENG/L0110S0100BLM21P.pdf?src-supplier=Future+Electronics; ComponentLink7Description: http://search.murata.co.jp/Ceramy/image/img/PDF/ENG/L0110S0100BLM21P.pdf?src-supplier=Future+Electronics; ComponentLink8URL: http://www.produktinfo.conrad.com/datenblaetter/1100000-1199999/001171738-da-01-en-CHIP_DROSSEL0805_22R0_6000MA_2_0X1_25MM.pdf?src-supplier=Conrad; ComponentLink8Description: http://www.produktinfo.conrad.com/datenblaetter/1100000-1199999/001171738-da-01-en-CHIP_DROSSEL0805_22R0_6000MA_2_0X1_25MM.pdf?src-supplier=Conrad; Supplier Part Number 1: BLM21PG220SN1D
J1 = CONN_2_POS__0353630260: CONN HEADER 2POS 2MM R/A TIN; Manufacturer: Molex, LLC; Contact Length - Post: 0.126" (3.20mm); Shrouding: Shrouded - 4 Wall; Number of Positions Loaded: All; Pitch - Mating: 0.079" (2.00mm); Style: Board to Cable/Wire; Number of Positions: 2; Contact Length - Mating: 0.145" (3.70mm); Material Flammability Rating: UL94 V-0; Contact Shape: Square; Contact Finish - Post: Tin; Contact Material: Brass; Contact Finish Thickness - Mating: 78.7µin (2.00µm); Contact Finish - Mating: Tin; Insulation Height: 0.217" (5.51mm); Contact Type: Male Pin; Manufacturer Part Number: 0353630260; RoHS: RoHS Compliant; Part Status: Active; Row Spacing - Mating: -; Packaging: Bulk; Termination: Solder; Category: Connectors, Interconnects; Mounting Type: Through Hole, Right Angle; Number of Rows: 1; Fastening Type: Locking Ramp; Overall Contact Length: -; Connector Type: Header; Supplier: Digi-Key; Insulation Material: Polyamide (PA), Nylon; Features: -; Insulation Color: Natural; Current Rating: -; Voltage Rating: -; Operating Temperature: -; Mated Stacking Heights: -; Contact Finish Thickness - Post: 78.7µin (2.00µm); Applications: Automotive, General Purpose; Ingress Protection: -; ComponentLink1URL: https://www.molex.com/pdm_docs/sd/353630260_sd.pdf; ComponentLink1Description: https://www.molex.com/pdm_docs/sd/353630260_sd.pdf; Pricing: 1=0.3, 10=0.286, 100=0.2002, 500=0.17158, 1000=0.14298, 5000=0.12255, 10000=0.11438 (USD); Supplier Part Number: WM18931-ND
J2 = USB_Micro_L-KLS1-233-1-0-0-T: Conn Micro USB 2.0 Type AB RCP 5 POS 0.65mm Solder RA SMD 5 Terminal 1 Port T/R; Manufacturer: KLS Electronic; ComponentLink1Description: Datasheet; ComponentLink1URL: https://cdn.ozdisan.com/ETicaret_Dosya/480449_6645382.pdf; Supplier Part Number 1: https://www.ozdisan.com/connectors-and-interconnects/usb-dvi-hdmi-connectors/usb-connectors/L-KLS1-233-1-0-0-T; Manufacturer Part Number: L-KLS1-233-1-0-0-T; Supplier 2: Digi-Key; RoHS: Yes; Category: Audio / Video Connectors; Stock 2: 25591; Pricing 2: 1=1,71000, 10=1,55200, 25=1,45720, 50=1,39380, 100=1,33050, 250=1,20380, 500=1,10876 (USD); ComponentLink2URL: https://www.te.com/commerce/DocumentDelivery/DDEController?Action=srchrtrv&amp;DocNm=1981584&amp;DocType=Customer+Drawing&amp;DocLang=English&src-supplier=Digi-Key; ComponentLink2Description: https://www.te.com/commerce/DocumentDelivery/DDEController?Action=srchrtrv&amp;DocNm=1981584&amp;DocType=Customer+Drawing&amp;DocLang=English&src-supplier=Digi-Key; Ozdisan: L-KLS1-233-1-0-0-T; Supplier Part Number 2: A97799CT-ND
L1 = DLW5BTM101SQ2L: 2 Line CommonModeChoke, SMD 6A
P1 = PTC__1812L075/33DR: PTC RESET FUSE 33V 750MA 1812; Manufacturer: Littelfuse Inc.; Approvals: cURus, TUV; Manufacturer Part Number: 1812L075/33DR; Category: Circuit Protection; Supplier: Digi-Key; Type: Polymeric; Voltage - Max: 33V; Operating Temperature: -40°C ~ 85°C; Ratings: -; RoHS: RoHS Compliant; Packaging: Tape & Reel (TR); Part Status: Active; Lead Spacing: -; Size / Dimension: 0.179" L x 0.128" W (4.55mm x 3.24mm); Mounting Type: Surface Mount; Package / Case: 1812 (4532 Metric), Concave; Height - Seated (Max): -; Thickness (Max): 0.061" (1.55mm); ComponentLink1URL: http://www.littelfuse.com/~/media/electronics/datasheets/resettable_ptcs/littelfuse_ptc_1812l_datasheet.pdf.pdf; ComponentLink1Description: http://www.littelfuse.com/~/media/electronics/datasheets/resettable_ptcs/littelfuse_ptc_1812l_datasheet.pdf.pdf; Pricing: 1500=0.25955, 3000=0.24613, 7500=0.24165, 10500=0.2327 (USD); Supplier Part Number: F3355TR-ND
R1 = ERJ-3GEYJ103V: RES SMD 10K OHM 5% 1/10W 0603; Manufacturer: Panasonic Electronic Components; Factory Stock: 0; Unit Price (USD): 0.00321; @ qty: 1500; Minimum Quantity: 1; Power (Watts): 0.1W, 1/10W; Temperature Coefficient: ±200ppm/°C; Part Number: ERJ-3GEYJ103V; Datasheets: http://industrial.panasonic.com/www-cgi/jvcr13pz.cgi?E+PZ+3+AOA0001+ERJ3GEYJ103V+7+WW; Image: //media.digikey.com/Photos/Panasonic%20Photos/MFG_ERJ-P6W%20Series.jpg; Digi-Key Part Number: P10KGCT-ND; Quantity Available: 7178118; Packaging: Cut Tape (CT); Series: ERJ; Part Status: Active; Value: 10k; Tolerance: ±5%; Composition: Thick Film; Features: Automotive AEC-Q200; Operating Temperature: -55°C ~ 155°C; Package / Case: 0603 (1608 Metric); Supplier Device Package: 0603; Size / Dimension: 0.063" L x 0.031" W (1.60mm x 0.80mm); Height - Seated (Max): 0.022" (0.55mm); Number of Terminations: 2; Failure Rate: -
R2 = ERJ-3EKF2400V: RES SMD 240 OHM 1% 1/10W 0603; Manufacturer: Panasonic Electronic Components; Factory Stock: 0; Unit Price (USD): 0.00379; @ qty: 1500; Minimum Quantity: 1; Power (Watts): 0.1W, 1/10W; Temperature Coefficient: ±100ppm/°C; Part Number: ERJ-3EKF2400V; Datasheets: http://industrial.panasonic.com/www-cgi/jvcr13pz.cgi?E+PZ+3+AOA0002+ERJ3EKF2400V+7+WW; Image: //media.digikey.com/Photos/Panasonic%20Photos/MFG_ERJ-P6W%20Series.jpg; Digi-Key Part Number: P240HCT-ND; Quantity Available: 36965; Packaging: Cut Tape (CT); Series: ERJ; Part Status: Active; Value: 240; Tolerance: ±1%; Composition: Thick Film; Features: Automotive AEC-Q200; Operating Temperature: -55°C ~ 155°C; Package / Case: 0603 (1608 Metric); Supplier Device Package: 0603; Size / Dimension: 0.063" L x 0.031" W (1.60mm x 0.80mm); Height - Seated (Max): 0.022" (0.55mm); Number of Terminations: 2; Failure Rate: -
R3 = ERJ-3EKF3300V: RES SMD 330 OHM 1% 1/10W 0603; Manufacturer: Panasonic Electronic Components; Factory Stock: 0; Unit Price (USD): 0.00379; @ qty: 1500; Minimum Quantity: 1; Power (Watts): 0.1W, 1/10W; Temperature Coefficient: ±100ppm/°C; Part Number: ERJ-3EKF3300V; Datasheets: http://industrial.panasonic.com/www-cgi/jvcr13pz.cgi?E+PZ+3+AOA0002+ERJ3EKF3300V+7+WW; Image: //media.digikey.com/Photos/Panasonic%20Photos/MFG_ERJ-P6W%20Series.jpg; Digi-Key Part Number: P330HCT-ND; Quantity Available: 670984; Packaging: Cut Tape (CT); Series: ERJ; Part Status: Active; Value: 330; Tolerance: ±1%; Composition: Thick Film; Features: Automotive AEC-Q200; Operating Temperature: -55°C ~ 155°C; Package / Case: 0603 (1608 Metric); Supplier Device Package: 0603; Size / Dimension: 0.063" L x 0.031" W (1.60mm x 0.80mm); Height - Seated (Max): 0.022" (0.55mm); Number of Terminations: 2; Failure Rate: -
R4 = ERJ-3EKF1601V: RES SMD 1.6K OHM 1% 1/10W 0603; Manufacturer: Panasonic Electronic Components; Factory Stock: 0; Unit Price (USD): 0.00379; @ qty: 1500; Minimum Quantity: 1; Power (Watts): 0.1W, 1/10W; Temperature Coefficient: ±100ppm/°C; Part Number: ERJ-3EKF1601V; Datasheets: http://industrial.panasonic.com/www-cgi/jvcr13pz.cgi?E+PZ+3+AOA0002+ERJ3EKF1601V+7+WW; Image: //media.digikey.com/Photos/Panasonic%20Photos/MFG_ERJ-P6W%20Series.jpg; Digi-Key Part Number: P1.60KHCT-ND; Quantity Available: 85768; Packaging: Cut Tape (CT); Series: ERJ; Part Status: Active; Value: 1.6k; Tolerance: ±1%; Composition: Thick Film; Features: Automotive AEC-Q200; Operating Temperature: -55°C ~ 155°C; Package / Case: 0603 (1608 Metric); Supplier Device Package: 0603; Size / Dimension: 0.063" L x 0.031" W (1.60mm x 0.80mm); Height - Seated (Max): 0.022" (0.55mm); Number of Terminations: 2; Failure Rate: -
R5 = ERJ-3EKF5600V: RES SMD 560 OHM 1% 1/10W 0603; Manufacturer: Panasonic Electronic Components; Factory Stock: 0; Unit Price (USD): 0.00379; @ qty: 1500; Minimum Quantity: 1; Power (Watts): 0.1W, 1/10W; Temperature Coefficient: ±100ppm/°C; Part Number: ERJ-3EKF5600V; Datasheets: http://industrial.panasonic.com/www-cgi/jvcr13pz.cgi?E+PZ+3+AOA0002+ERJ3EKF5600V+7+WW; Image: //media.digikey.com/Photos/Panasonic%20Photos/MFG_ERJ-P6W%20Series.jpg; Digi-Key Part Number: P560HCT-ND; Quantity Available: 121996; Packaging: Cut Tape (CT); Series: ERJ; Part Status: Active; Value: 560; Tolerance: ±1%; Composition: Thick Film; Features: Automotive AEC-Q200; Operating Temperature: -55°C ~ 155°C; Package / Case: 0603 (1608 Metric); Supplier Device Package: 0603; Size / Dimension: 0.063" L x 0.031" W (1.60mm x 0.80mm); Height - Seated (Max): 0.022" (0.55mm); Number of Terminations: 2; Failure Rate: -
R6 = ERJ-6GEYJ105V: RES SMD 1M OHM 5% 1/8W 0805; Manufacturer: Panasonic Electronic Components; Factory Stock: 0; Unit Price (USD): 0.00496; @ qty: 1500; Minimum Quantity: 1; Power (Watts): 0.125W, 1/8W; Temperature Coefficient: ±200ppm/°C; Part Number: ERJ-6GEYJ105V; Datasheets: http://industrial.panasonic.com/www-cgi/jvcr13pz.cgi?E+PZ+3+AOA0001+ERJ6GEYJ105V+7+WW; Image: //media.digikey.com/Renders/Panasonic%20Renders/ERJ-0805%20Pkg.jpg; Digi-Key Part Number: P1.0MACT-ND; Quantity Available: 231835; Packaging: Cut Tape (CT); Series: ERJ; Part Status: Active; Value: 1M; Tolerance: ±5%; Composition: Thick Film; Features: Automotive AEC-Q200; Operating Temperature: -55°C ~ 155°C; Package / Case: 0805 (2012 Metric); Supplier Device Package: 0805; Size / Dimension: 0.079" L x 0.049" W (2.00mm x 1.25mm); Height - Seated (Max): 0.028" (0.70mm); Number of Terminations: 2; Failure Rate: -
R42 = ERJ-3EKF4702V: RES SMD 47K OHM 1% 1/10W 0603; Manufacturer: Panasonic Electronic Components; Factory Stock: 0; Unit Price (USD): 0.00379; @ qty: 1500; Minimum Quantity: 1; Power (Watts): 0.1W, 1/10W; Temperature Coefficient: ±100ppm/°C; Datasheets: http://industrial.panasonic.com/www-cgi/jvcr13pz.cgi?E+PZ+3+AOA0002+ERJ3EKF4702V+7+WW; Image: //media.digikey.com/Photos/Panasonic%20Photos/MFG_ERJ-P6W%20Series.jpg; Digi-Key Part Number: P47.0KHCT-ND; Quantity Available: 3596527; Packaging: Cut Tape (CT); Series: ERJ; Part Status: Active; Value: 47k; Tolerance: ±1%; Composition: Thick Film; Features: Automotive AEC-Q200; Operating Temperature: -55°C ~ 155°C; Package / Case: 0603 (1608 Metric); Supplier Device Package: 0603; Size / Dimension: 0.063" L x 0.031" W (1.60mm x 0.80mm); Height - Seated (Max): 0.022" (0.55mm); Number of Terminations: 2; Failure Rate: -; Manufacturer Part Number: ERJ-3EKF4702V
R43 = ERJ-3EKF4701V: RES SMD 4.7K OHM 1% 1/10W 0603; Manufacturer: Panasonic Electronic Components; Factory Stock: 0; Unit Price (USD): 0.00379; @ qty: 1500; Minimum Quantity: 1; Power (Watts): 0.1W, 1/10W; Temperature Coefficient: ±100ppm/°C; Datasheets: http://industrial.panasonic.com/www-cgi/jvcr13pz.cgi?E+PZ+3+AOA0002+ERJ3EKF4701V+7+WW; Image: //media.digikey.com/Photos/Panasonic%20Photos/MFG_ERJ-P6W%20Series.jpg; Digi-Key Part Number: P4.70KHCT-ND; Quantity Available: 999380; Packaging: Cut Tape (CT); Series: ERJ; Part Status: Active; Value: 4.7k; Tolerance: ±1%; Composition: Thick Film; Features: Automotive AEC-Q200; Operating Temperature: -55°C ~ 155°C; Package / Case: 0603 (1608 Metric); Supplier Device Package: 0603; Size / Dimension: 0.063" L x 0.031" W (1.60mm x 0.80mm); Height - Seated (Max): 0.022" (0.55mm); Number of Terminations: 2; Failure Rate: -; Manufacturer Part Number: ERJ-3EKF4701V
R44 = ERJ-3EKF5602V: RES SMD 56K OHM 1% 1/10W 0603; Manufacturer: Panasonic Electronic Components; Factory Stock: 0; Unit Price (USD): 0.00379; @ qty: 1500; Minimum Quantity: 1; Power (Watts): 0.1W, 1/10W; Temperature Coefficient: ±100ppm/°C; Datasheets: http://industrial.panasonic.com/www-cgi/jvcr13pz.cgi?E+PZ+3+AOA0002+ERJ3EKF5602V+7+WW; Image: //media.digikey.com/Photos/Panasonic%20Photos/MFG_ERJ-P6W%20Series.jpg; Digi-Key Part Number: P56.0KHCT-ND; Quantity Available: 179827; Packaging: Cut Tape (CT); Series: ERJ; Part Status: Active; Value: 56k; Tolerance: ±1%; Composition: Thick Film; Features: Automotive AEC-Q200; Operating Temperature: -55°C ~ 155°C; Package / Case: 0603 (1608 Metric); Supplier Device Package: 0603; Size / Dimension: 0.063" L x 0.031" W (1.60mm x 0.80mm); Height - Seated (Max): 0.022" (0.55mm); Number of Terminations: 2; Failure Rate: -; Manufacturer Part Number: ERJ-3EKF5602V
U1 U2 = LM317MDCY: IC REG LINEAR ADJ 0.5A SOT223; Manufacturer: Texas Instruments; Regulator Topology: Positive Adjustable; Current - Output: 500mA; Voltage - Output: 1.25 V ~ 37 V; Voltage - Input: 4.2 V ~ 40 V; Packaging: Tape & Reel (TR); Manufacturer Part Number: LM317MDCYR; Supplier: Digi-Key; Part Status: Active; RoHS: RoHS Compliant; Supplier Device Package: SOT-223-4; Package / Case: TO-261-4, TO-261AA; Voltage - Dropout (Typical): -; Mounting Type: Surface Mount; Current - Limit (Min): -; Operating Temperature: 0°C ~ 125°C; Category: Integrated Circuits (ICs); ComponentLink1URL: http://www.ti.com/lit/ds/symlink/lm317m.pdf; ComponentLink1Description: http://www.ti.com/lit/ds/symlink/lm317m.pdf; Pricing: 2500=0.319, 5000=0.297, 12500=0.286 (USD); Supplier Part Number: 296-12631-2-ND
U3 = USBLC6-2SC6: TVS DIODE 5.25V 17V SOT23-6; Manufacturer: STMicroelectronics; Voltage - Breakdown (Min): 6V; Current - Peak Pulse (10/1000µs): 5A (8/20µs); Power Line Protection: Yes; Voltage - Reverse Standoff (Typ): 5.25V; Type: Steering (Rail to Rail); Part Status: Active; Supplier: Digi-Key; Packaging: Tape & Reel (TR); Category: Circuit Protection; RoHS: RoHS Compliant; Manufacturer Part Number: USBLC6-2SC6; Mounting Type: Surface Mount; Applications: Ethernet; Operating Temperature: -40°C ~ 125°C (TJ); Capacitance @ Frequency: -; Package / Case: SOT-23-6; Power - Peak Pulse: -; Voltage - Clamping (Max) @ Ipp: 17V; Supplier Device Package: SOT-23-6; Base Part Number: USBLC6-2; ComponentLink1URL: http://www.st.com/content/ccc/resource/technical/document/datasheet/06/1d/48/9c/6c/20/4a/b2/CD00050750.pdf/files/CD00050750.pdf/jcr:content/translations/en.CD00050750.pdf; ComponentLink1Description: http://www.st.com/content/ccc/resource/technical/document/datasheet/06/1d/48/9c/6c/20/4a/b2/CD00050750.pdf/files/CD00050750.pdf/jcr:content/translations/en.CD00050750.pdf; Pricing: 3000=0.16828, 6000=0.15743, 15000=0.14657, 30000=0.14476 (USD); Supplier Part Number: 497-5235-2-ND
V1 = VARISTOR_82541250: VARISTOR 39V 200A 1206; Manufacturer: Wurth Electronics Inc.; Number of Circuits: 1; Maximum AC Volts: 25VAC; Capacitance @ Frequency: 620pF @ 1kHz; Maximum DC Volts: 30VDC; Energy: 1.0J; Varistor Voltage (Min): 35.88V; Varistor Voltage (Max): 42.12V; Operating Temperature: -40°C ~ 125°C (TA); Packaging: Tape & Reel (TR); Category: Circuit Protection; Part Status: Active; RoHS: RoHS Compliant; Package / Case: 1206 (3216 Metric); Varistor Voltage (Typ): 39V; Mounting Type: Surface Mount, MLCV; Supplier: Digi-Key; Manufacturer Part Number: 82541250; ComponentLink1URL: http://katalog.we-online.de/pbs/datasheet/82541250.pdf; ComponentLink1Description: http://katalog.we-online.de/pbs/datasheet/82541250.pdf; Pricing: 3000=0.564 (USD); Supplier Part Number: 732-2553-2-ND

## Nets that join several sheets
+3V3: MCU (12 pins), Com_Canbus (C21.1 C22.1 U5.3 U6.5), Com_Uart (12 pins), Relay (8 pins), Wifi (R39.1 R40.2 U12.4), Power (D2.1)
GND: MCU (15 pins), Com_Canbus (6 pins), Com_Uart (12 pins), Relay (Q1.1 Q1.4 Q2.1 Q2.4), Wifi (9 pins), Power (20 pins)
CANRX: MCU (U4.45), Com_Canbus (R14.1)
CANTX: MCU (U4.46), Com_Canbus (R15.1)
Detect_24V: MCU (U4.15), Power (R1.2)
ESP_ENABLE: MCU (U4.19), Wifi (C27.1 R32.1 U11.3)
ESP_POWER_EN: MCU (U4.18), Wifi (R41.2)
RELAY_1_RESET: MCU (U4.40), Relay (Q1.5)
RELAY_1_SET: MCU (U4.39), Relay (Q1.2)
RELAY_2_RESET: MCU (U4.42), Relay (Q2.5)
RELAY_2_SET: MCU (U4.41), Relay (Q2.2)
Uart_Rx_1: MCU (U4.31), Com_Uart (U7.3)
Uart_Rx_2: MCU (U4.13), Com_Uart (U9.3)
Uart_Rx_3: MCU (R9.1 U4.22), Wifi (R33.1)
Uart_Tx_1: MCU (U4.30), Com_Uart (R20.1 U7.2)
Uart_Tx_2: MCU (U4.12), Com_Uart (R24.1 U9.2)
Uart_Tx_3: MCU (R8.1 U4.21), Wifi (R38.1)
USB_DM: MCU (U4.32), Power (U3.6)
USB_DP: MCU (U4.33), Power (U3.4)
USB_POWER_DETECT: MCU (U4.16), Power (C28.1 R42.2 R44.2)